# EAGLE board PCB-CCU-IRISCTRL (EAGLE 7.1.0)
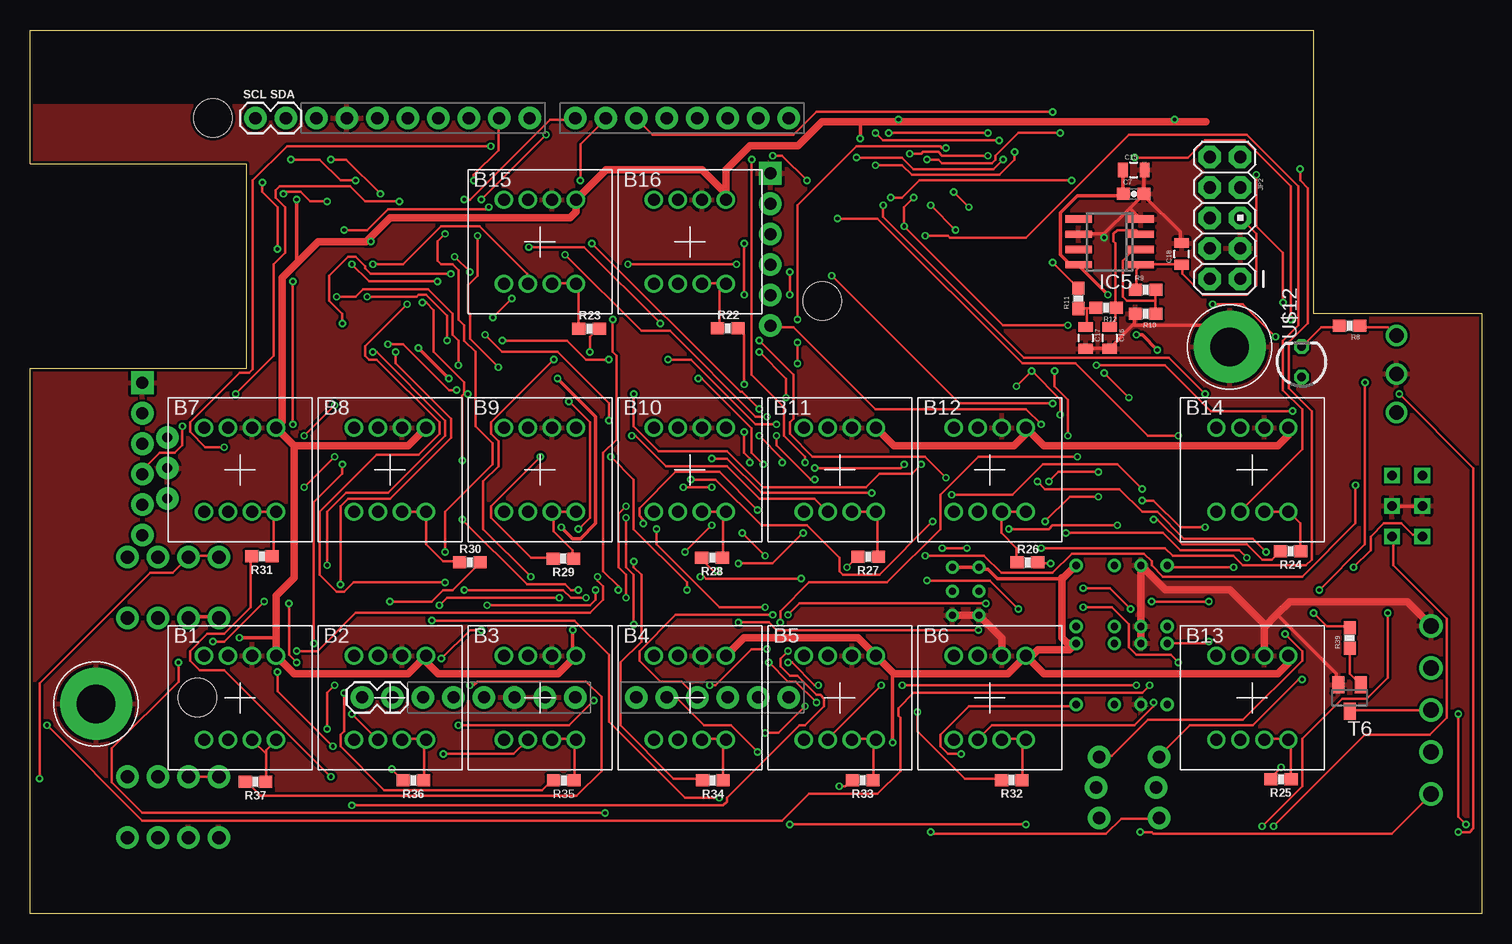
[diagram p5: board, top side]
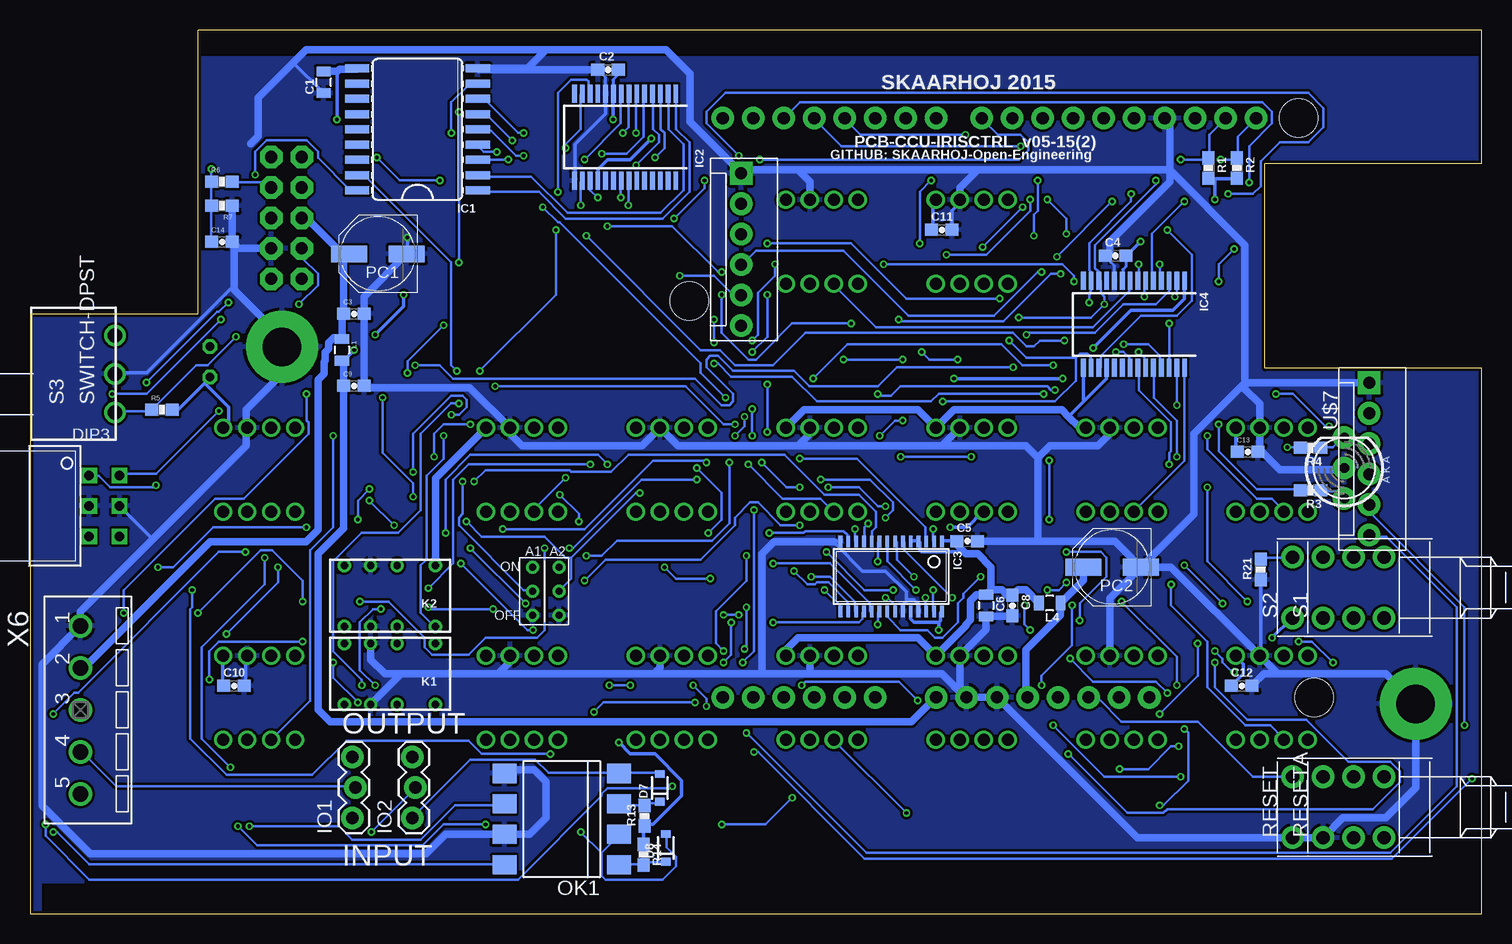
[diagram p6: board, bottom side, seen from below]

Size 121 x 73.66 mm. Coordinates in mm from the lower left corner, seen from the top.
Outline: 0,0 0,45.47 18.05,45.47 18.05,62.5 0,62.5 0,73.66 107,73.66 107,50 121,50 121,0 0,0
Copper layers (1*16): Top 0.035mm / dielectric 1.5mm / Bottom 0.035mm
Design rules "Fusion_eagle_rule_v1.1": minimum track width 6mil, minimum drill 12mil, track to track 6mil, track to pad 6mil, pad to pad 6mil, via to via 6mil, smd to smd 0mil, copper to edge 10mil, drill to drill 10mil, minimum pad ring 10mil, minimum via ring 6mil, stop-mask expansion 2mil, vias tented up to drill 100mil, thermal gap 10mil
Net classes: 0 default: width 0.203 mm, clearance 0.203 mm; 1 Power: width 0.305 mm, drill 0.305 mm, clearance 0.203 mm; 2 RELAY LINES: width 0.305 mm, drill 0.305 mm, clearance 0.203 mm; 3 INput lines: width 0.203 mm, clearance 0.203 mm
Holes 3.2 mm at 66.04,51.07 15.24,66.31 13.97,18.05
tRestrict: area 0,0 to 120,6.5; area 0,67.5 to 107,74
bRestrict: area 0,71.5 to 107,74; area 0,0 to 120,2.5

## Footprints (pad centres in the part's own frame; a part is rotated, then mirrored left to right if it is on the bottom)
NKK-NP01 = drill 1: 1 1,3.5; 2 -1,-3.5; L1 3,-3.5; L2 1,-3.5; L3 -1,3.5; L4 -3,3.5; LC1 3,3.5; LC2 -3,-3.5
0805 = smd 0.8 x 1.2: 1 -0.9,0; 2 0.9,0
0603-CAP = smd 1.1 x 1: 1 -0.85,0; 2 0.85,0
SOD-323 = smd 0.63 x 0.83: 1 -1.15,0; 2 1.15,0
P65SMT_UPRIGHT_TH = drill 0.8 square: P$1 -2.54,-1.27; P$2 0,-1.27; P$3 2.54,-1.27; P$4 2.54,1.27; P$5 0,1.27; P$6 -2.54,1.27
DUEMILANOVE_VIAS = drill 1.016 pad 1.88: 3.3V 50.8,13.97; 5V 50.8,16.51; A0 50.8,29.21; A1 50.8,31.75; A2 50.8,34.29; A3 50.8,36.83; A4 50.8,39.37; A5 50.8,41.91; AREF 2.54,2.54; D2 2.54,36.83; D3 2.54,34.29; D4 2.54,31.75; D5 2.54,29.21; D6 2.54,26.67; D7 2.54,24.13; D8 2.54,20.32; D9 2.54,17.78; D10 2.54,15.24; D11 2.54,12.7; D12 2.54,10.16; D13 2.54,7.62; GND@0 50.8,19.05; GND@1 50.8,21.59; GND@2 2.54,5.08; RES 50.8,11.43; RX 2.54,41.91; TX 2.54,39.37; VIN 50.8,24.13
SO18W = smd 0.66 x 2.032: 1 -5.08,-5.029; 2 -3.81,-5.029; 3 -2.54,-5.029; 4 -1.27,-5.029; 5 0,-5.029; 6 1.27,-5.029; 7 2.54,-5.029; 8 3.81,-5.029; 9 5.08,-5.029; 10 5.08,5.029; 11 3.81,5.029; 12 2.54,5.029; 13 1.27,5.029; 14 0,5.029; 15 -1.27,5.029; 16 -2.54,5.029; 17 -3.81,5.029; 18 -5.08,5.029
SSOP28 = smd 0.4 x 1.5: 1 -4.225,-3.625; 2 -3.575,-3.625; 3 -2.925,-3.625; 4 -2.275,-3.625; 5 -1.625,-3.625; 6 -0.975,-3.625; 7 -0.325,-3.625; 8 0.325,-3.625; 9 0.975,-3.625; 10 1.625,-3.625; 11 2.275,-3.625; 12 2.925,-3.625; 13 3.575,-3.625; 14 4.225,-3.625; 15 4.225,3.625; 16 3.575,3.625; 17 2.925,3.625; 18 2.275,3.625; 19 1.625,3.625; 20 0.975,3.625; 21 0.325,3.625; 22 -0.325,3.625; 23 -0.975,3.625; 24 -1.625,3.625; 25 -2.275,3.625; 26 -2.925,3.625; 27 -3.575,3.625; 28 -4.225,3.625
TSSOP28 = smd 0.305 x 0.991: 1 -4.225,-2.918; 2 -3.575,-2.918; 3 -2.925,-2.918; 4 -2.275,-2.918; 5 -1.625,-2.918; 6 -0.975,-2.918; 7 -0.325,-2.918; 8 0.325,-2.918; 9 0.975,-2.918; 10 1.625,-2.918; 11 2.275,-2.918; 12 2.925,-2.918; 13 3.575,-2.918; 14 4.225,-2.918; 15 4.225,2.918; 16 3.575,2.918; 17 2.925,2.918; 18 2.275,2.918; 19 1.625,2.918; 20 0.975,2.918; 21 0.325,2.918; 22 -0.325,2.918; 23 -0.975,2.918; 24 -1.625,2.918; 25 -2.275,2.918; 26 -2.925,2.918; 27 -3.575,2.918; 28 -4.225,2.918
SO08 = smd 0.6 x 2.2: 1 -1.905,-2.6; 2 -0.635,-2.6; 3 0.635,-2.6; 4 1.905,-2.6; 5 1.905,2.6; 6 0.635,2.6; 7 -0.635,2.6; 8 -1.905,2.6
1X03_LOCK = drill 1.016 pad 1.88: 1 0,0.127; 2 2.54,-0.127; 3 5.08,0.127
1X02 = drill 1.016 pad 1.88: 1 0,0; 2 2.54,0
AVR_ICSP = drill 1.016 pad 1.88 octagon: 1 -1.27,5.08; 2 1.27,5.08; 3 -1.27,2.54; 4 1.27,2.54; 5 -1.27,0; 6 1.27,0; 7 -1.27,-2.54; 8 1.27,-2.54; 9 -1.27,-5.08; 10 1.27,-5.08
MOLEX-1X6 = drill 1.016 pad 1.88 square: 1 0,0 | drill 1.016 pad 1.88: 2 2.54,0; 3 5.08,0; 4 7.62,0; 5 10.16,0; 6 12.7,0
DS2Y = drill 0.6: 1 1.2,0.46; 16 1.2,5.54; O1 4.4,0.46; O2 4.4,5.54; P1 6.6,0.46; P2 6.6,5.54; S1 8.8,0.46; S2 8.8,5.54
DIL8-SMD = smd 1.6 x 2: 1 -3.81,-4.77; 2 -1.27,-4.77; 3 1.27,-4.77; 4 3.81,-4.77; 5 3.81,4.77; 6 1.27,4.77; 7 -1.27,4.77; 8 -3.81,4.77
PANASONIC_D = smd 3 x 1.4: + 2.4,0; - -2.4,0
0603-RES = smd 1.1 x 1: 1 -0.85,0; 2 0.85,0
PUSHBUTTON = drill 1.1 pad 1.88: 1 2.54,2.54; 2 2.54,-2.54; 3 -2.54,2.54; 4 -2.54,-2.54
TECONNECTIVITY-DPST = drill 1.2: P$1 3,3.2; P$2 3,0; P$3 3,-3.2
SOT23 = smd 1 x 1.4: 1 -0.95,-1.1; 2 0.95,-1.1; 3 0,1.1
3.2MMPAD6MM = drill 3.2 pad 6: P$1 0,0
LED5MM-BICOLOR = drill 0.813 pad 1.88: A2 2.54,0; A3 -2.54,0; K1 0,0
LED3MM = drill 0.7 pad 1.2 octagon: A -1.27,0; K 1.27,0
2BITADDR = drill 0.6: A1 0,0; A2 2.2,0; H2 0,2; H3 2.2,2; L2 0,-2; L3 2.2,-2
MSTBV5-3.5 = drill 1.3: 1 -7,0; 2 -3.5,0; 3 0,0; 4 3.5,0; 5 7,0

## Placement (x,y rotation side)
B1  NKK-NP01-SINGLECOLOR  [NKK-NP01]  17.5,18 0 top
B2  NKK-NP01-SINGLECOLOR  [NKK-NP01]  30,18 0 top
B3  NKK-NP01-SINGLECOLOR  [NKK-NP01]  42.5,18 0 top
B4  NKK-NP01-SINGLECOLOR  [NKK-NP01]  55,18 0 top
B5  NKK-NP01-SINGLECOLOR  [NKK-NP01]  67.5,18 0 top
B6  NKK-NP01-SINGLECOLOR  [NKK-NP01]  80,18 0 top
B7  NKK-NP01-SINGLECOLOR  [NKK-NP01]  17.5,37 0 top
B8  NKK-NP01-SINGLECOLOR  [NKK-NP01]  30,37 0 top
B9  NKK-NP01-SINGLECOLOR  [NKK-NP01]  42.5,37 0 top
B10  NKK-NP01-SINGLECOLOR  [NKK-NP01]  55,37 0 top
B11  NKK-NP01-SINGLECOLOR  [NKK-NP01]  67.5,37 0 top
B12  NKK-NP01-SINGLECOLOR  [NKK-NP01]  80,37 0 top
B13  NKK-NP01-SINGLECOLOR  [NKK-NP01]  101.88,18 0 top
B14  NKK-NP01-SINGLECOLOR  [NKK-NP01]  101.88,37 0 top
B15  NKK-NP01-SINGLECOLOR  [NKK-NP01]  42.5,56 0 top
B16  NKK-NP01-SINGLECOLOR  [NKK-NP01]  55,56 0 top
C1  100nF  [0805]  96.52,69.31 90 bottom
C2  100nF  [0603-CAP]  72.81,70.35 0 bottom
C3  100nF  [0603-CAP]  94,50 0 bottom
C4  100nF  [0603-CAP]  30.51,54.86 0 bottom
C5  100nF  [0603-CAP]  42.87,31.07 0 bottom
C6  22uF  [0805]  41.3,25.7 270 bottom
C7  100nF  [0603-CAP]  92,60 0 top
C8  100nF  [0603-CAP]  39.1,25.7 270 bottom
C9  100nF  [0603-CAP]  94,44 0 bottom
C10  100nF  [0603-CAP]  104,19 0 bottom
C11  100nF  [0603-CAP]  45,57 0 bottom
C12  100nF  [0603-CAP]  20,19 0 bottom
C13  100nF  [0603-CAP]  19.5,38.5 0 bottom
C14  100nF  [0603-CAP]  105,56 0 bottom
C15  10uF/25V  [0805]  92,62 0 top
C16  1uF  [0805]  90,48 270 top
C17  1uF  [0805]  88,48 270 top
C18  10uF  [0805]  96,55 90 top
D7  1N4148  [SOD-323]  68.5,10.5 90 bottom
D8  1N4148  [SOD-323]  68,5.5 90 bottom
DIP3  BINARY_DIPUPRIGHT  [P65SMT_UPRIGHT_TH]  114.8,34 270 bottom
GND  ARDUINO_SHIELDNO_SILK  [DUEMILANOVE_VIAS]  21.34,68.85 270 top
IC1  ULN2803A  [SO18W]  88.7,65.38 90 bottom
IC2  MCP23017SS  [SSOP28]  71.39,64.73 180 bottom
IC3  PCA9685  [TSSOP28]  49.21,28.12 180 bottom
IC4  MCP23017SS  [SSOP28]  28.97,49.12 180 bottom
IC5  LM358D  [SO08]  90,56 90 top
IO1  [1X03_LOCK]  94,8 90 bottom
IO2  [1X03_LOCK]  89,8 90 bottom
JP1  [1X02]  27.69,18.05 0 top
JP2  M05X2PTH  [AVR_ICSP]  99.62,58 180 top
JP3  [MOLEX-1X6]  61.72,61.72 270 bottom
JP4  [1X02]  21.34,66.31 180 top
JP5  [MOLEX-1X6]  9.36,44.26 270 bottom
K1  RELAY5VIM03  [DS2Y]  86,23 180 bottom
K2  RELAY5VIM03  [DS2Y]  86,29.5 180 bottom
L1  ILHB0805ER121V  [0805]  95,47 270 bottom
L4  ILHB0805ER121V  [0805]  36,25.9 180 bottom
OK1  LTV826S  [DIL8-SMD]  76.67,7.9 90 bottom
PC1  47u  [PANASONIC_D]  92,55 180 bottom
PC2  47u  [PANASONIC_D]  30.8,28.9 180 bottom
R1  1K5  [0603-RES]  22.77,62.15 270 bottom
R2  1K5  [0603-RES]  20.4,62.15 270 bottom
R3  270  [0603-RES]  14.24,35.29 180 bottom
R4  270  [0603-RES]  14.24,38.83 180 bottom
R5  10K  [0603-RES]  110,42 0 bottom
R6  15K  [0603-RES]  105,61 0 bottom
R7  10K  [0603-RES]  105,59 180 bottom
R8  330R  [0603-RES]  110,49 180 top
R9  12K5  [0603-RES]  93,52 0 top
R10  22K  [0603-RES]  93,50 180 top
R11  22K  [0603-RES]  87.4,51.3 90 top
R12  10K  [0603-RES]  89.7,50.5 180 top
R13  330R  [0603-RES]  69.76,8.18 90 bottom
R14  330R  [0603-RES]  69.86,4.93 270 bottom
R21  10K  [0603-RES]  18.41,28.72 90 bottom
R22  100R  [0603-RES]  58.16,48.8 0 top
R23  100R  [0603-RES]  46.61,48.77 0 top
R24  100R  [0603-RES]  105.09,30.23 180 top
R25  100R  [0603-RES]  104.28,11.23 180 top
R26  100R  [0603-RES]  83.15,29.29 0 top
R27  100R  [0603-RES]  69.88,29.75 180 top
R28  100R  [0603-RES]  56.86,29.68 180 top
R29  100R  [0603-RES]  44.47,29.61 180 top
R30  100R  [0603-RES]  36.66,29.3 0 top
R31  100R  [0603-RES]  19.32,29.8 180 top
R32  100R  [0603-RES]  81.84,11.16 180 top
R33  100R  [0603-RES]  69.41,11.14 180 top
R34  100R  [0603-RES]  56.93,11.12 180 top
R35  100R  [0603-RES]  44.48,11.12 180 top
R36  100R  [0603-RES]  31.96,11.12 180 top
R37  100R  [0603-RES]  18.81,11 180 top
R39  10K  [0603-RES]  110,23 90 top
RESET  [PUSHBUTTON]  13.21,8.89 90 bottom
RESETA  [PUSHBUTTON]  10.67,8.89 90 bottom
S1  [PUSHBUTTON]  10.67,27.19 90 bottom
S2  [PUSHBUTTON]  13.21,27.19 90 bottom
S3  SWITCH-DPST  [TECONNECTIVITY-DPST]  116.9,45 0 bottom
T6  BC847  [SOT23]  110,18 180 top
U$4  GNDPAD6MM  [3.2MMPAD6MM]  100,47.25 0 top
U$7  LEDBICOLOR-AKA  [LED5MM-BICOLOR]  11.44,37.16 90 bottom
U$12  LED3MM  [LED3MM]  106,46 90 top
U$19  2BITADDR  [2BITADDR]  79.1,26.89 0 bottom
U$20  GNDPAD6MM  [3.2MMPAD6MM]  5.5,17.5 0 top
X6  MSTBV53.5MM  [MSTBV5-3.5]  116.8,17 270 bottom

## Tracks (layer width: path | path; a pad name or v marks a point on that pad's centre or on a via)
5V  (via drill 0.3)
  Top 0.305: S1.3 13.34,24.77 15.72,24.77 S2.3 | U$19.H3 76.99,28.89 79.06,28.89 U$19.H2 79.22,28.73 79.85,28.73 80.64,27.94 86,27.94 | 69.22,66 v69.22,64.61 | v71.91,14.29 71.91,19.84 72,20 | v22.23,59.53 22.23,54.61 22.42,54.42 | v45.24,23.65 45.24,21.59 B3.LC1 | v72.39,66.2 72.39,66 | v28.42,56.04 28.23,56.23 | v95.41,66.2 95.41,66 | 20.5,23.02 v17.46,23.02
  Top 0.61: B3.LC1 44,20 34,20 33,21 B2.LC1 31.5,20 22,20 B1.LC1 20.5,23.02 20.5,26.5 22,28 22,39 | 22,39 B7.LC1 21,41 21,53 22.42,54.42 24,56 28,56 28.23,56.23 30,58 45,58 45.5,58.5 B15.LC1 48,62 56,62 58,60 B16.LC1 58,62 60,64 64,64 66,66 69.22,66 72.39,66 95.41,66 98,66 | 22,39 31.5,39 B8.LC1 | B11.LC1 72,39 82,39 83,40 B12.LC1 84.5,39 104,39 104.88,39.88 B14.LC1 | B6.LC1 81.5,20 72,20 B5.LC1 69,23 59.5,23 B4.LC1 | B6.LC1 83.5,21.5 84,22 86.66,22 K1.1 86.46,22.54 86,23 86,27.94 86,28 86.16,28 K2.1 | B13.LC1 104.88,20.88 104,20 84.5,20 B6.LC1
  Bottom 0.254: C2.2 71.96,69.94 72.4,69.5 72.4,68.39 IC2.9 | C4.2 29.66,53.94 29.9,53.7 29.9,52.79 IC4.9
  Bottom 0.305: 106.44,44.21 106.05,44.61 U$12.A | 106.44,44.21 108.58,42.07 109.06,42.07 R5.2 | 45.24,24.29 45.09,24.45 45.09,25.08 IC3.28 | 45.24,24.29 47.31,24.29 47.62,24.61 47.62,25.08 IC3.24 | 22.23,61.28 22.7,61.28 R1.2 | 22.23,61.28 20.48,61.28 R2.2 | R14.1 69.85,5.87 69.85,7.3 R13.1 69.69,7.46 69.06,7.46 66.67,9.84 66.67,11.11 68.9,13.34 70.96,13.34 v71.91,14.29 | IC3.5 47.47,31.11 46.99,31.11 IC3.4 46.83,30.96 46.83,30.32 46.67,30.16 43.5,30.16 43.33,30.33 | IC3.1 44.93,31.11 44.29,31.11 44,31 | C12.1 20.8,19.05 19.84,20 19.84,20.8 20.48,21.43 B1.LC1 | C13.1 20.48,38.58 20.48,40.48 B7.LC1 | C11.1 45.72,57.15 45.72,59.21 45.56,59.37 B15.LC1 | C10.1 104.93,19.05 104.93,21.43 B13.LC1 | 34.44,41.44 33.1,42.78 | 33.1,42.78 31.27,44.61 31.27,45.4 IC4.18 | IC4.15 33.18,45.4 33.18,42.86 33.1,42.78 | v69.22,64.61 70.96,62.87 72.87,62.87 73.66,62.07 IC2.18 | v22.23,59.53 22.23,61.28 | v45.24,23.65 45.24,24.29 | v72.39,66.2 72.39,68.26 IC2.9 | v28.42,56.04 29.53,54.93 C4.2 | v95.41,66.2 95.41,70.01 95.39,70.21 | 106.44,44.21 104.46,42.23 104.46,40.96 104.78,40.64 B14.LC1 | v17.46,23.02 15.88,24.61 S2.3
  Bottom 0.61: L4.2 38,27 38.65,27 C8.1 39.55,26.55 40,27 40.9,27 | 40.9,27 C6.1 42.1,26.6 42.6,26.1 42.6,24.5 43,24.1 43,24 B3.LC1 47,23 57,23 58,22 B4.LC1 | C1.2 95.39,70.21 95.2,70.4 93.79,70.4 IC1.10 | 40.9,27 40.9,28.9 42,30 43,30 43.33,30.33 44,31 43.79,31 C5.1 | B8.LC1 33.5,40.5 34.44,41.44 35,42 44,42 B9.LC1 47,42 56.5,42 B10.LC1 | K2.1 87.2,36.3 B12.LC1
_IRIS_MANUAL  (via drill 0.3)
  Top 0.203: v98.58,50.8 101.12,50.8 v103.82,48.1
  Bottom 0.203: S3.P$3 113.82,41.91 110.97,41.91 R5.1 110.81,42.07 107.16,45.72 106.2,45.72 v103.82,48.1 | v98.58,50.8 97,52.39 97,53.34 98.27,54.61 98.27,55.4 JP2.4
A1  (via drill 0.3)
  Top 0.203: v45.72,32.07 46.67,33.02 46.67,40.96 v44.93,42.7 | v77.15,56.99 v75.09,59.05 | v85.88,41.59 85.88,42.86 v83.5,45.24 v82.23,43.97 | v89.06,36.83 85.72,36.83 v84.93,36.04 | v39.37,47.78 44.77,47.78 46.35,46.2 v48.26,46.2 | v53.18,46.2 55.09,46.2 60.48,40.8 v62.23,40.8
  Bottom 0.203: v45.72,32.07 45.72,31.11 IC3.2 | v44.93,42.7 35.56,42.7 33.81,44.45 33.81,46.35 | 33.81,46.35 33.5,46.67 32.86,46.67 32.54,46.35 32.54,45.56 IC4.16 | v75.09,59.05 75.09,60.96 IC2.16 | v77.15,56.99 77.15,51.59 v83.5,45.24 | v85.88,41.59 85.25,41.59 84.61,42.23 84.61,42.86 84.93,43.18 85.88,43.18 89.06,40.01 v89.06,36.83 | v84.93,36.04 84.93,33.34 85.25,33.02 85.25,32.38 79.85,26.99 79.22,26.99 U$19.A1 | 33.81,46.35 37.94,46.35 v39.37,47.78 | v53.18,46.2 v48.26,46.2 | v62.23,40.8 63.18,40.8 66.36,43.97 v82.23,43.97
A1CFG  (via drill 0.3)
  Top 0.203: S2.1 15.72,29.84 13.34,29.84 S1.1 13.18,29.69 11.91,28.42 10,28.42 0.79,19.21 v0.79,11.27 | v60.64,13.49 58.42,15.72 56.2,15.72 53.98,17.94 53.18,17.94 GND.A1
  Bottom 0.203: R21.2 18.41,29.69 15.88,29.69 S2.1 | v60.64,13.49 60.33,13.49 51.44,4.6 7.46,4.6 v0.79,11.27
A2  (via drill 0.3)
  Top 0.203: v56.83,37.94 58.1,37.94 60.96,35.08 v70.17,35.08 | v26.19,56.99 28.1,56.99 29.84,58.74 38.1,58.74 v38.26,58.9 | v41.59,55.56 46.2,55.56 v52.55,49.21 | v63.34,53.5 v63.34,51.59 | v73.66,59.69 72.87,58.9 v72.87,57.31 81.12,49.05 v86.52,49.05 | v84.61,32.7 86.68,34.77 v89.06,34.77 | v89.53,45.09 v91.6,43.02
  Bottom 0.203: v56.83,37.94 52.07,37.94 46.35,32.23 46.35,31.11 IC3.3 | v70.17,35.08 70.48,35.08 75.88,29.69 | 75.88,29.69 75.88,27.94 76.83,26.99 U$19.A2 | v26.19,56.99 24.13,54.93 24.13,51.12 25.4,49.85 28.42,49.85 31.75,46.51 31.75,45.56 IC4.17 | v41.59,55.56 v38.26,58.9 | v52.55,49.21 57.47,49.21 60.48,46.2 61.12,46.2 63.34,48.42 v63.34,51.59 | v63.34,53.5 63.66,53.5 67.47,57.31 v72.87,57.31 | v73.66,59.69 74.3,60.33 74.3,60.96 IC2.17 | 75.88,29.69 76.36,29.69 78.11,31.43 83.34,31.43 v84.61,32.7 | v89.06,34.77 89.06,35.88 91.6,38.42 v91.6,43.02 | v89.53,45.09 89.53,46.04 v86.52,49.05
ADDR1  (via drill 0.3)
  Top 0.203: v110.49,35.72 110.49,32.54 106.05,28.1 94.46,28.1 93.5,29.05 93.5,29.37 92.87,30 86.84,30 85.25,28.42 80.96,28.42 79.53,29.84 v74.61,29.84 | v62.71,37.62 62.71,37.94 v60.8,39.85 | v60.8,42.07 59.37,43.5 59.21,43.5 v46.83,55.88 | v45.88,61.12 45.88,64.14 47.94,66.2 GND.D6
  Bottom 0.203: v110.49,35.72 110.65,35.56 114.3,35.56 115.25,36.51 116.05,36.51 DIP3.P$1 | v74.61,29.84 73.34,29.84 72.07,31.11 64.14,31.11 62.71,32.54 v62.71,37.62 | v60.8,42.07 v60.8,39.85 | v46.83,55.88 46.83,60.17 v45.88,61.12
ADDR2  (via drill 0.3)
  Top 0.203: v103.66,7.3 111.28,14.92 116.68,14.92 118.11,16.35 118.11,24.61 113.67,29.05 113.67,31.43 DIP3.P$4 | v63.34,7.46 v83.03,7.46 | v57.47,9.68 54.61,9.68 48.26,16.03 48.26,21.59 45.4,24.45 v33.5,24.45 | v34.61,30.16 34.61,33.5 38.58,37.47 38.58,39.21 37.15,40.64 37.15,46.83 36.2,47.78 36.2,49.05 35.72,49.53 35.72,53.66 35.24,54.13 34.29,54.13 33.97,54.45 33.97,56.04 v34.61,56.67 | v36.2,59.53 36.67,59.53 43.34,66.2 45.4,66.2 GND.D7
  Bottom 0.203: v103.66,7.3 102.08,5.71 88.27,5.71 86.52,7.46 v83.03,7.46 | v63.34,7.46 59.69,7.46 v57.47,9.68 | v33.5,24.45 33.5,25.88 31.27,28.1 31.27,29.69 31.75,30.16 v34.61,30.16 | v34.61,56.67 34.61,57.94 v36.2,59.53
ADDR3  (via drill 0.3)
  Top 0.203: v110.33,28.89 111.76,30.32 111.76,31.43 112.87,32.54 114.3,32.54 115.25,31.59 116.05,31.59 DIP3.P$3 | v97.95,32.23 95.89,32.23 93.66,34.45 v92.71,34.45 | v90.65,32.38 85.25,32.38 84.93,32.07 v81.6,32.07 | v64.61,37.62 64.61,38.1 62.87,39.85 62.87,42.23 60.17,44.93 v60.17,62.87
  Bottom 0.203: v110.33,28.89 109.06,28.89 105.73,32.23 v97.95,32.23 | v90.65,32.38 v92.71,34.45 | v81.6,32.07 74.77,32.07 69.06,37.78 64.77,37.78 v64.61,37.62 | v60.17,62.87 38.58,62.87 37.78,63.66 37.78,64.29 38.42,64.93 40.32,64.93 41.59,66.2 GND.D8
ADDR4  (via drill 0.3)
  Top 0.203: v105.25,41.91 98.42,41.91 94.61,45.72 v88.9,45.72 | v39.05,45.56 36.67,47.94 36.67,50.01 36.51,50.16 36.51,52.39 37.31,53.18 v37.31,56.52 | v36.99,61.12 36.99,61.59 39.05,63.66 39.05,66.2 GND.D9
  Bottom 0.203: v105.25,41.91 110.49,36.67 113.51,36.67 DIP3.P$6 | v88.9,45.72 86.84,45.72 85.72,44.61 65.56,44.61 63.34,42.39 62.71,42.39 62.39,42.7 62.39,43.34 64.61,45.56 64.61,46.2 64.29,46.51 63.66,46.51 62.39,45.24 57.31,45.24 56.04,43.97 50.32,43.97 48.74,45.56 v39.05,45.56 | v37.31,56.52 37.31,58.26 36.99,58.58 v36.99,61.12
ARD_5V
  Bottom 0.61: PC2.+ 33.2,27.8 L4.1 35.1,24.9 38,22 38,18.2 GND.5V
D2  (via drill 0.3)
  Top 0.203: v21.91,52.7 v21.91,40.8 | v20.64,55.4 20.64,58.9 19.37,60.17 v19.37,60.96
  Bottom 0.203: v21.91,40.8 21.91,38.58 18.73,35.4 15.24,35.4 R3.2 | v21.91,52.7 21.91,54.13 v20.64,55.4 | v19.37,60.96 19.37,63.98 17.46,65.88 17.46,66.83 18.26,67.63 56.83,67.63 58.1,66.36 GND.D2
D3  (via drill 0.3)
  Top 0.203: v16.19,38.89 14.61,38.89 13.34,40.16 13.34,40.96 17.46,45.09 18.26,45.09 18.57,45.4 18.57,61.12 21.43,63.98 v38.42,63.98
  Bottom 0.203: v16.19,38.89 15.24,38.89 R4.2 | v38.42,63.98 53.34,63.98 55.56,66.2 GND.D3
FOLLOW_IRIS  (via drill 0.3)
  Top 0.203: v105.89,62.07 105.89,61.12 106.52,60.48 106.52,49.21 104.93,47.62 104.93,43.81 106.84,41.91 106.84,29.53 106.36,29.05 101.12,29.05 100.33,29.84 95.25,29.84 94.61,30.48 v84.3,30.48 | v79.69,25.88 64.14,25.88 v63.18,24.92 | v61.91,24.92 53.82,24.92 50.8,21.91 50.8,21.11 52.55,19.37 54.29,19.37 55.56,18.1 GND.A2
  Bottom 0.203: C14.1 105.89,56.04 105.89,58.9 R7.2 105.89,59.05 105.89,60.96 R6.1 105.89,61.12 v105.89,62.07 | v79.69,25.88 v84.3,30.48 | v61.91,24.92 v63.18,24.92
GND  (via drill 0.3)
  Top 0.305: C7.2 92.87,60.01 92.87,61.91 C15.2 | C18.2 95.89,56.04 95.89,56.83 92.87,59.85 C7.2 | 89.53,56.67 87.47,56.67 IC5.6 | 91.68,58.82 92.71,59.85 C7.2 | 91.68,58.82 89.53,56.67 | 91.68,58.82 92.55,57.94 IC5.4 | 92,49.13 90.01,47.15 C16.2 89.85,47.15 88.11,47.15 C17.2 | 92,49.13 92.08,49.21 92.08,49.85 R10.2 | DIP3.P$5 113.67,33.97 116.05,33.97 DIP3.P$2 | 103.95,24.95 108.9,20 108.9,19.21 T6.2 | 92,49.13 92.08,49.05 98.11,49.05 99.85,47.31 U$4.P$1 | v89.53,56.36 89.53,56.67
  Top 0.61: K1.P1 K2.P2 K2.P1 94.64,27 100,27 102.88,24.12 B13.1 102.88,23.88 103.95,24.95 105,26 114.8,26 X6.1 | B6.1 81,22.99 U$19.L2 U$19.L3
  Bottom 0.254: IC2.10 73.02,69.7 C2.1 | IC4.10 30.59,53.99 30.9,54.3 30.9,54.4 C4.1 | IC3.14 53.96,31.04 54,31
  Bottom 0.305: 47.86,26.11 48.26,25.72 48.26,25.24 IC3.23 | 47.86,26.11 47.78,26.19 47.31,26.19 46.99,25.88 46.99,25.24 IC3.25 | R21.1 18.41,21.75 B1.1 | C11.2 44.13,57.15 44.13,58.58 43.5,59.21 B15.1 | C10.2 103.03,19.05 103.03,21.43 B13.1 | C3.2 93.19,50.01 C3.2 | 99.05,70.95 96.52,68.42 C1.1 | IC2.15 75.56,61.12 75.56,64.14 73.03,66.67 73.03,68.26 IC2.10 | 47.86,26.11 47.94,26.19 47.94,26.83 49.69,28.57 51.59,28.57 53.82,30.8 54,31 | 110.77,31.23 113.51,33.97 DIP3.P$5 | S3.P$2 113.82,45.09 111.28,45.09 104.3,52.07 104,52 | v89.53,56.36 89.53,55.24 PC1.-
  Bottom 0.61: GND.GND@1 GND.GND@0 28.69,6.35 RESET.3 RESETA.3 11.56,8 8,8 5.5,10.5 U$20.P$1 8,20 17,20 | GND.GND@1 43.05,18.05 45,20 56,20 | 56,20 60,20 | 60,20 69,20 | 69,20 82,20 | PC1.- 93.15,51.45 C3.2 C9.2 93,43.85 84.35,43.85 B12.1 81,40 80,39 70,39 B11.1 67,39 57,39 | C14.2 104,55.85 104,52 100,48 U$4.P$1 100,45 103,42 103,40.62 B14.1 103,40.38 103,39 110.77,31.23 116.8,25.2 X6.1 120,20.8 120,9 116,5 88,5 86.37,6.63 OK1.7 79.37,6.63 78,8 78,11 79,12 81.15,12 OK1.5 | C14.2 R7.1 | JP2.3 103.61,55.46 C14.2 | B6.1 81,21 82,20 | B2.1 31,26.3 PC2.- | PC2.- 25.9,28.9 B1.1 17,20 | 17,20 18.15,20 C12.2 | JP5.1 19.74,44.26 | 19.74,44.26 24,40 24,33.3 PC2.- | 19.74,44.26 19.74,55.74 26,62 | 26,62 26,65.89 GND.GND@2 | 26,62 42,62 | 42,62 57,62 | 61.44,62 JP3.1 | C8.2 39.15,24.8 C6.2 41.3,23.7 B3.1 43.5,18.62 GND.GND@1 | 26,62 26,61 31,56 31,55.21 C4.1 | C2.1 83.56,70.35 IC1.9 79.54,70.46 78,72 | C5.2 37,31.07 | 37,31.07 30.57,31.07 PC2.- | B4.1 56,20 | 54,31 59,31 60,30 60,20 | 82,20 90.06,20 | 90.06,20 K1.P2 | 90.06,20 91.4,20 92.6,21.2 K1.P1 | B5.1 68.5,20.5 69,20 | B10.1 56,40 57,39 | 57,39 45,39 | 45,39 B9.1 | 45,39 38,39 37,38 | 37,38 37,31.07 | 19.74,44.26 19.74,43.74 18.5,42.5 B7.1 18.5,38.65 C13.2 18.3,38.5 16.8,37 11.6,37 U$7.K1 | B8.1 31,40 32,39 36,39 37,38 | 61.44,62 62,62 66,66 66,70 68,72 78,72 | 78,72 98,72 99.05,70.95 102,68 102,64.8 102.6,64.2 | 61.44,62 57,62 | 57,62 56,61 B16.1 | B15.1 43.5,60.5 42,62
  pour Top: 0,0 121,0 121,74 0,74
  pour Bottom: 0,0 121,0 121,74 0,74
GPA0  (via drill 0.3)
  Top 0.203: v30.48,46.83 30.48,45.88 35.08,41.27 35.08,39.69 30,34.61 26.51,34.61 25.88,33.97 v25.88,27.46
  Bottom 0.203: v30.48,46.83 29.84,46.83 29.37,46.35 29.37,45.56 IC4.21 | v25.88,27.46 25.88,25.72 22.86,22.7 22.86,18.89 19.68,15.72 17.62,15.72 16.51,14.61 B1.2
GPA1  (via drill 0.3)
  Top 0.203: v26.04,37.47 26.04,36.67 23.65,34.29 v23.65,22.54 | v26.83,16.67 28.89,14.61 B2.2
  Bottom 0.203: v26.04,37.47 26.04,38.42 25.88,38.58 25.88,40.96 28.57,43.66 28.57,45.4 IC4.22 | v23.65,22.54 23.65,19.84 v26.83,16.67
GPA2  (via drill 0.3)
  Top 0.203: v28.57,46.83 28.89,46.83 34.61,41.12 34.61,39.85 29.84,35.08 26.35,35.08 24.77,33.5 v24.77,29.05 | v21.59,25.88 21.59,21.59 v22.23,20.95 | v34.45,13.34 40.32,13.34 41.43,14.45 B3.2
  Bottom 0.203: v28.57,46.83 28.1,46.35 28.1,45.56 IC4.23 | v21.59,25.88 v24.77,29.05 | v22.23,20.95 22.23,18.89 19.53,16.19 14.61,16.19 11.11,12.7 7.62,12.7 6.83,11.91 6.83,10.95 9.05,8.73 26.19,8.73 26.51,8.41 29.53,8.41 v34.45,13.34
GPA3  (via drill 0.3)
  Top 0.203: v22.86,35.56 v25.4,38.1 | v19.53,26.04 16.19,22.7 v15.24,22.7 | v12.38,20.95 12.38,19.37 6.83,13.81 6.83,10.95 9.37,8.41 v47.94,8.41
  Bottom 0.203: v25.4,38.1 25.4,41.12 27.3,43.02 27.3,45.4 IC4.24 | v22.86,35.56 22.86,29.37 v19.53,26.04 | v15.24,22.7 14.13,22.7 v12.38,20.95 | v47.94,8.41 53.98,14.45 B4.2
GPA4  (via drill 0.3)
  Top 0.203: v29.84,47.47 31.11,47.47 34.92,43.66 v35.56,43.66 | v50.32,43.34 50.32,40.64 52.39,38.58 58.1,38.58 61.12,35.56 69.69,35.56 70.8,36.67 73.5,36.67 v74.3,37.47 | v87.79,27.15 90.01,27.15 v91.76,25.4 | v72.71,19.05 v92.23,19.05 | v70.96,19.05 66.52,14.61 B5.2
  Bottom 0.203: v29.84,47.47 27.78,47.47 26.83,46.51 26.83,45.56 IC4.25 | v35.56,43.66 35.88,43.66 36.2,43.97 48.42,43.97 49.21,43.18 50.16,43.18 v50.32,43.34 | v74.3,37.47 84.45,37.47 85.72,36.2 85.72,29.21 v87.79,27.15 | v91.76,25.4 92.39,25.4 93.5,24.29 93.5,20.32 v92.23,19.05 | v70.96,19.05 v72.71,19.05
GPA5  (via drill 0.3)
  Top 0.203: v26.04,49.21 26.04,50.01 24.92,51.12 24.92,53.18 26.51,54.77 27.15,54.77 27.94,53.98 27.94,53.82 28.42,53.34 v35.08,53.34 | v48.58,49.53 48.58,46.83 48.9,46.51 48.9,39.53 47.78,38.42 47.78,28.57 49.05,27.3 v49.05,26.99 | v56.83,32.38 v54.61,30.16 | v74.77,27.78 80.01,27.78 v82.39,25.4 | v87.79,25.56 90.17,25.56 91.6,24.13 91.6,22.23 92.23,21.59 95.09,21.59 v95.73,20.95 | v93.66,17.62 93.66,17.3 92.08,15.72 80.17,15.72 79.06,14.61 B6.2
  Bottom 0.203: v26.04,49.21 26.04,45.56 IC4.26 | v35.08,53.34 35.88,53.34 39.85,49.37 48.42,49.37 v48.58,49.53 | v49.05,26.99 51.44,26.99 v54.61,30.16 | v56.83,32.38 58.42,32.38 60.33,34.29 60.96,34.29 62.23,33.02 62.23,32.38 65.09,29.53 73.03,29.53 v74.77,27.78 | v82.39,25.4 87.63,25.4 v87.79,25.56 | v95.73,20.95 95.73,19.68 v93.66,17.62
GPA6  (via drill 0.3)
  Top 0.203: v22.86,39.85 v25.4,42.39
  Bottom 0.203: v25.4,42.39 25.4,45.4 IC4.27 | v22.86,39.85 22.86,38.73 18.73,34.61 17.46,34.61 16.51,33.66 B7.2
GPA7
  Bottom 0.203: IC4.28 24.77,45.4 24.77,37.78 28.89,33.66 B8.2
GPB0  (via drill 0.3)
  Top 0.305: v34.92,44.61 v32.38,47.15 | v43.97,44.61 47.15,41.43 47.15,32.54 45.88,31.27 45.24,31.27 v44.29,32.23
  Bottom 0.305: v32.38,47.15 29.21,50.32 25.72,50.32 24.77,51.28 24.77,52.7 IC4.1 | v43.97,44.61 v34.92,44.61 | v44.29,32.23 42.86,32.23 41.59,33.5 B9.2
GPB1  (via drill 0.3)
  Top 0.203: v25.56,51.44 27.15,51.44 27.78,52.07 33.18,52.07 35.24,50.01 35.24,48.26 35.72,47.78 v35.72,45.72 | v55.72,44.61 56.04,44.61 60.17,40.48 60.17,38.42 v61.12,37.47
  Bottom 0.203: v25.56,51.44 25.4,51.59 25.4,52.7 IC4.2 | v35.72,45.72 38.26,45.72 40.01,47.47 52.86,47.47 v55.72,44.61 | v61.12,37.47 58.26,34.61 55.09,34.61 54.13,33.66 B10.2
GPB2  (via drill 0.3)
  Top 0.203: v37.94,48.26 39.37,46.83 43.97,46.83 48.26,42.55 v48.26,41.12 | v50.16,39.85 50.48,39.85 53.02,37.31 58.1,37.31 60.8,34.61 65.41,34.61 66.36,33.66 B11.2
  Bottom 0.203: v37.94,48.26 37.78,48.42 32.23,48.42 29.84,50.8 27.15,50.8 26.04,51.91 26.04,52.7 IC4.3 | v48.26,41.12 48.9,41.12 v50.16,39.85
GPB3  (via drill 0.3)
  Top 0.203: v26.83,54.13 28.26,52.7 v33.97,52.7 | v58.9,54.13 v49.85,54.13 | v60.8,47.78 63.66,44.93 63.66,41.27 63.34,40.96 63.34,40.01 65.25,38.1 74.61,38.1 v76.36,36.35
  Bottom 0.203: v26.83,54.13 26.83,52.86 IC4.4 | v33.97,52.7 33.97,53.18 34.92,54.13 v49.85,54.13 | v58.9,54.13 58.9,53.18 60.33,51.75 60.33,48.26 v60.8,47.78 | v76.36,36.35 79.06,33.66 B12.2
GPB4  (via drill 0.3)
  Top 0.203: v24.77,59.37 23.34,59.37 22.54,60.17 21.27,60.17 v21.11,60.01 | v61.91,63.18 62.71,63.18 v64.77,61.12 | v67.31,57.94 70.64,57.94 82.71,45.88 87.15,45.88 93.19,39.85 v95.73,39.85
  Bottom 0.203: v24.77,59.37 27.46,56.67 27.46,52.86 IC4.5 | v21.11,60.01 19.05,60.01 18.41,60.64 18.41,62.71 16.83,64.29 14.45,64.29 13.18,65.56 13.18,67.15 14.45,68.42 63.02,68.42 64.61,66.83 64.61,65.88 v61.91,63.18 | v64.77,61.12 64.77,60.48 v67.31,57.94 | v95.73,39.85 95.73,32.23 97.63,30.32 97.63,17.78 100.81,14.61 B13.2
GPB5  (via drill 0.3)
  Top 0.203: v28.1,51.44 32.23,51.44 32.38,51.59 33.02,51.59 34.77,49.85 v34.77,47.78 | v74.61,56.52 76.52,56.52 76.68,56.36 83.03,56.36 91.6,64.93 101.44,64.93 105.73,60.64 105.73,49.05 104.46,47.78 104.46,43.66 106.05,42.07 106.05,38.73 100.97,33.66 B14.2
  Bottom 0.203: v28.1,51.44 28.1,52.7 IC4.6 | v34.77,47.78 36.83,47.78 37.31,47.31 37.94,47.31 39.05,48.42 56.36,48.42 59.05,45.72 62.23,45.72 63.5,46.99 65.09,46.99 v74.61,56.52
GPB6  (via drill 0.3)
  Top 0.203: v28.57,54.13 31.11,54.13 34.29,57.31 37.47,57.31 41.43,53.34 41.43,52.55 B15.2
  Bottom 0.203: v28.57,54.13 28.57,52.86 IC4.7
GPB7
  Bottom 0.203: IC4.8 29.37,52.7 29.37,51.91 32.38,48.9 50.48,48.9 53.98,52.39 B16.2
I2C_SCL  (via drill 0.3)
  Top 0.203: v46.35,26.35 45.09,26.35 44.45,26.99 v36.2,26.99 | v34.61,27.62 26.99,27.62 26.19,26.83 25.56,26.83 24.13,28.26 24.13,33.5 28.89,38.26 32.38,38.26 34.13,40.01 34.13,40.96 28.89,46.2 28.26,46.2 27.94,46.51 27.94,47.31 v31.43,50.8 | v78.26,58.9 v76.99,60.17 | v63.02,43.02 63.02,44.61 v60.8,46.83 | v59.53,55.88 v59.53,51.59 | v38.58,49.69 v40.16,51.28 | v21.75,62.87 24.13,62.87 25.88,61.12 v27.15,61.12
  Bottom 0.203: JP4.2 18.89,66.2 20.32,64.77 20.32,63.02 R2.1 20.48,62.87 v21.75,62.87 | v46.35,26.35 46.35,25.24 IC3.26 | v36.2,26.99 35.24,26.99 v34.61,27.62 | v76.99,60.17 76.99,68.42 75.88,69.53 74.61,69.53 74.45,69.37 74.45,68.42 IC2.12 | v78.26,58.9 76.99,57.63 76.83,57.63 65.09,45.88 65.09,45.09 v63.02,43.02 | v60.8,46.83 59.53,48.1 v59.53,51.59 | v59.53,55.88 52.55,55.88 47.94,51.28 v40.16,51.28 | v38.58,49.69 32.54,49.69 v31.43,50.8 31.43,51.44 31.75,51.75 31.75,52.7 IC4.12 31.91,52.86 31.91,53.5 32.23,53.82 32.23,55.72 27.15,60.8 v27.15,61.12
I2C_SDA  (via drill 0.3)
  Top 0.203: v45.72,26.99 45.09,26.99 44.61,27.46 41.43,27.46 v36.04,32.86 | v36.04,37.78 36.04,43.18 36.2,43.34 | 36.2,43.34 36.2,44.29 33.66,46.83 33.66,50.32 33.02,50.96 v32.7,50.96 | v76.36,63.82 76.04,63.82 75.88,63.98 68.9,63.98 63.98,59.05 v63.98,49.53 | v63.98,45.88 v63.98,47.62 | 36.2,43.34 v36.51,43.34 | v25.08,62.87 26.35,62.87 v29.21,60.01
  Bottom 0.203: JP4.1 21.43,66.2 22.7,64.93 22.7,63.02 R1.1 22.86,62.87 v25.08,62.87 | v45.72,26.99 45.72,25.24 IC3.27 | v36.04,37.78 v36.04,32.86 | v32.7,50.96 32.7,51.75 32.54,51.91 32.54,52.7 IC4.13 32.54,52.86 32.54,53.5 32.7,53.66 32.7,55.88 29.21,59.37 v29.21,60.01 | v76.36,63.82 76.36,64.14 75.09,65.41 75.09,68.26 IC2.13 | v63.98,47.62 v63.98,49.53 | v63.98,45.88 63.66,45.88 62.55,44.77 57.47,44.77 55.4,42.7 45.88,42.7 45.24,43.34 v36.51,43.34
IRIS_CONTROL
  Top 0.203: R9.1 92.23,52.07 92.23,53.66 92.55,53.98 IC5.1 92.71,54.13 95.89,54.13 C18.1 96.04,53.98 96.04,53.34 97.79,51.59 101.44,51.59 102.23,52.39 102.23,56.67 100.97,57.94 JP2.5
L0
  Top 0.203: 19.68,13.34 19.68,13.65 20.48,14.45 B1.L1 | 19.68,13.34 19.68,11.11 R37.1 | 19.68,13.34 18.57,14.45 B1.L2
L1
  Top 0.203: R36.1 32.86,11.27 32.86,14.45 B2.L1 32.86,14.61 31.11,14.61 B2.L2
L2
  Top 0.203: R35.1 45.4,11.27 45.4,14.45 B3.L1 45.4,14.61 43.66,14.61 B3.L2
L3
  Top 0.203: R34.1 57.78,11.27 57.78,14.29 57.94,14.45 B4.L1 57.94,14.61 56.04,14.61 B4.L2
L4
  Top 0.203: R33.1 70.33,11.27 70.33,14.29 70.48,14.45 B5.L1 70.48,14.61 68.58,14.61 B5.L2
L5
  Top 0.203: R32.1 82.71,11.27 82.71,14.29 82.87,14.45 B6.L1 82.87,14.61 81.12,14.61 B6.L2
L6
  Top 0.203: 20.48,33.5 20.32,33.34 20.32,29.84 R31.1 | 20.48,33.5 18.57,33.5 B7.L2 | 20.48,33.5 B7.L1
L7
  Top 0.203: R30.1 35.72,29.37 34.45,29.37 33.02,30.8 33.02,33.5 B8.L1 32.86,33.5 31.11,33.5 B8.L2
L8
  Top 0.203: 43.66,33.5 43.66,31.91 45.24,30.32 45.24,29.69 R29.1 | 43.66,33.5 45.4,33.5 B9.L1 | 43.66,33.5 B9.L2
L9
  Top 0.203: 57.94,33.5 57.78,33.34 57.78,29.69 R28.1 | 57.94,33.5 56.04,33.5 B10.L2 | 57.94,33.5 B10.L1
L10
  Top 0.203: R27.1 70.64,29.84 70.64,33.5 B11.L1 70.48,33.5 68.58,33.5 B11.L2
L11
  Top 0.203: R26.1 82.23,29.37 82.23,30.48 80.96,31.75 80.96,33.5 B12.L2 81.12,33.5 82.87,33.5 B12.L1
L12
  Top 0.203: R25.1 105.09,11.27 105.09,14.29 B13.L1 104.78,14.61 103.03,14.61 B13.L2
L13
  Top 0.203: R24.1 105.89,30.32 105.89,32.54 104.93,33.5 B14.L1 104.78,33.5 103.03,33.5 B14.L2
L14
  Top 0.203: R23.1 45.72,48.9 45.72,52.23 45.56,52.39 B15.L1 45.4,52.55 43.66,52.55 B15.L2
L15
  Top 0.203: R22.1 57.47,48.9 57.47,51.91 57.94,52.39 B16.L1 57.94,52.55 56.04,52.55 B16.L2
N$1  (via drill 0.3)
  Top 0.203: v100.33,28.89 94.93,28.89 K2.S1 | v104.62,23.34 106.05,21.91 106.05,21.11 101.12,16.19 93.19,16.19 90.17,13.18 89.22,13.18 IO2.3
  Bottom 0.203: v100.33,28.89 100.33,27.62 v104.62,23.34
N$2  (via drill 0.3)
  Top 0.203: v61.28,29.84 v59.37,31.75 | v63.18,21.91 62.55,21.27 62.55,20.64 63.34,19.84 63.98,19.84 65.56,18.26 65.88,18.26 66.2,17.94 66.2,17.3 64.61,15.72 64.14,15.72 58.1,9.68 58.1,9.37 57.78,9.05 v26.83,9.05 | v24.77,15.4 24.77,18.41 v25.4,19.05 | v30,26.04 33.5,26.04 34.45,26.99 35.24,26.99 37.47,29.21 R30.2
  Bottom 0.203: v59.37,31.75 56.52,31.75 56.36,31.91 53.18,31.91 52.86,31.59 52.86,31.11 IC3.13 | v61.28,29.84 61.28,27.78 63.82,25.24 63.82,22.54 v63.18,21.91 | v26.83,9.05 26.51,9.05 24.45,11.11 24.45,15.08 v24.77,15.4 | v25.4,19.05 25.4,21.43 v30,26.04
N$3  (via drill 0.3)
  Top 0.203: v12.7,40.64 12.7,39.05 12.06,38.42 10.79,38.42 9.37,36.99 9.37,36.67 JP5.4 | v17.14,43.34 20.32,46.51 20.32,54.13 21.27,55.09 21.27,58.9 20.48,59.69 20.48,60.33 20.8,60.64 26.67,60.64 27.94,59.37 v30.8,59.37 | v36.67,53.5 v35.4,54.77
  Bottom 0.203: v12.7,40.64 13.02,40.64 15.72,43.34 v17.14,43.34 | v35.4,54.77 v30.8,59.37 | v36.67,53.5 36.99,53.5 40.64,49.85 47.78,49.85 53.18,55.24 60.48,55.24 61.59,54.13 JP3.4
N$4  (via drill 0.3)
  Top 0.203: v102.23,61.59 102.23,57.31 104.46,55.09 v104.46,50.96 | v111.28,44.29 111.28,30.8 v107.47,26.99 | v77.63,13.34 76.52,13.34 75.88,13.97 75.88,14.92 78.26,17.3 87.15,17.3 K1.16
  Bottom 0.203: v102.23,61.59 102.23,63.5 101.28,64.45 97.95,64.45 97,63.5 97,63.02 94.3,60.33 93.82,60.33 IC1.18 | v104.46,50.96 105.25,50.16 105.41,50.16 v111.28,44.29 | v107.47,26.99 107.47,25.56 107.63,25.4 107.63,14.61 104.62,11.59 97.47,11.59 94.61,14.45 84.45,14.45 83.34,13.34 v77.63,13.34
N$5
  Bottom 0.203: IC2.1 67.15,68.26 67.15,65.41 66.04,64.29 66.04,60.17 68.26,57.94 76.36,57.94 78.58,60.17 83.66,60.17 IC1.1
N$6  (via drill 0.3)
  Top 0.203: v92.55,6.83 93.5,6.83 93.66,6.67 113.51,6.67 116.68,9.84 X6.5
  Bottom 0.203: v92.55,6.83 88.9,10.48 IO2.2
N$7
  Bottom 0.203: R4.1 13.34,38.89 12.38,38.89 11.59,39.69 U$7.A2
N$8  (via drill 0.3)
  Top 0.203: v1.43,15.72 9.37,7.78 62.71,7.78 64.93,10 70.64,10 72.55,11.91 72.55,16.35 72.39,16.51 72.39,17.14 73.66,18.41 92.71,18.41 v93.34,19.05 | v85.25,42.55 77.47,42.55 v66.83,53.18
  Bottom 0.203: v1.43,15.72 1.43,25.56 9.21,33.34 9.21,33.97 JP5.5 | v93.34,19.05 93.34,19.53 95.73,21.91 95.73,29.37 93.34,31.75 90.33,31.75 88.42,33.66 88.42,40.01 85.88,42.55 v85.25,42.55 | v66.83,53.18 63.98,53.18 62.39,51.59 61.75,51.59 JP3.5
N$9  (via drill 0.3)
  Top 0.203: v85.41,45.24 85.41,43.97 86.52,42.86 v86.52,39.85
  Bottom 0.203: v85.41,45.24 85.88,45.72 85.88,54.29 93.03,61.44 93.66,61.44 IC1.17 | v86.52,39.85 86.52,37.94 87.95,36.51 87.95,29.53 88.42,29.05 88.42,25.08 87.31,23.97 K2.16
N$10  (via drill 0.3)
  Top 0.203: v98.27,22.7 98.11,22.54 94.93,22.54 K1.S1 | v106.05,19.53 105.73,19.53 101.92,15.72 96.68,15.72 94.14,13.18 IO1.3
  Bottom 0.203: v98.27,22.7 105.25,22.7 106.05,21.91 v106.05,19.53
N$11
  Bottom 0.203: R3.1 13.34,35.24 12.06,35.24 11.59,34.77 U$7.A3
N$12
  Bottom 0.203: IO1.2 93.98,10.64 113.82,10.64 116.68,13.49 X6.4
N$13
  Top 0.203: R39.1 110.01,22.07 110.01,20 110.81,19.21 T6.1
N$14
  Bottom 0.203: R6.2 104.14,60.96 101.28,60.96 100.97,60.64 JP2.7
N$15
  Top 0.203: R8.1 110.97,48.9 113.19,48.9 113.82,48.26 S3.P$1
N$16
  Bottom 0.61: JP2.6 98,58 95,55 PC1.+ 94.85,54.55 C3.1 95,49.85 L1.1 95.1,48 95.7,48 96.1,47.6 96.1,47.1 96.4,46.8 96.4,46.1 96.5,46 96.5,45 97,44.5 97,32 98,31 106,31 116.5,20.5 X6.2
N$17
  Top 0.203: R8.2 109.06,48.9 107.63,48.9 106.05,47.31 U$12.K
N$18
  Top 0.203: 88.11,50.48 88.74,50.48 R12.2 | 88.11,50.48 87.47,50.48 R11.1 | 88.11,50.48 88.11,49.05 C17.1
N$19  (via drill 0.3)
  Top 0.203: v52.23,32.07 52.23,30.8 57.47,25.56 v61.28,25.56 | v61.44,22.07 60.17,22.07 57.15,19.05 v56.67,19.05 | v46.99,17.78 44.93,15.72 v35.72,15.72 | v25.08,11.43 16.19,20.32 14.13,20.32 13.34,21.11 13.34,21.91 14.76,23.34 16.19,23.34 18.41,25.56 18.41,29.69 R31.2
  Bottom 0.203: v52.23,32.07 52.23,31.11 IC3.12 | v61.28,25.56 61.28,22.23 v61.44,22.07 | v56.67,19.05 56.36,19.37 48.58,19.37 v46.99,17.78 | v35.72,15.72 31.43,11.43 v25.08,11.43
N$20
  Top 0.203: C16.1 90.01,49.05 90.49,49.53 90.49,50.48 R12.1 90.49,50.64 90.49,55.88 90.33,56.04 90.33,56.67 90.65,56.99 92.23,56.99 92.55,56.67 IC5.3
N$22
  Top 0.203: 93.82,51.12 93.82,51.91 R9.2 | 93.82,51.12 93.82,50.01 R10.1 | 93.82,51.12 91.44,51.12 91.12,51.44 91.12,54.45 91.92,55.24 92.55,55.24 IC5.2
N$23  (via drill 0.3)
  Top 0.203: v51.12,32.54 51.12,32.86 50.8,33.18 50.8,33.81 53.82,36.83 57.47,36.83 v60.64,33.66 | v61.59,20.95 63.18,19.37 63.82,19.37 v65.56,17.62 | v73.98,16.83 73.98,15.24 77.95,11.27 80.96,11.27 R32.2
  Bottom 0.203: v51.12,32.54 51.44,32.23 51.44,31.11 IC3.11 | v60.64,33.66 60.64,21.91 v61.59,20.95 | v65.56,17.62 73.18,17.62 v73.98,16.83
N$31  (via drill 0.3)
  Top 0.203: v83.98,36.04 84.61,35.4 90.81,35.4 92.71,33.5 93.98,33.5 96.2,31.27 101.92,31.27 v103.03,30.16 | v119.06,16.67 119.06,8.1 v119.7,7.46 | v67.47,10.64 67.94,10.64 68.42,11.11 R33.2
  Bottom 0.203: v83.98,36.04 83.03,36.99 76.04,36.99 75.88,36.83 72.55,36.83 71.12,38.26 58.1,38.26 54.77,34.92 51.91,34.92 50.48,33.5 50.48,32.23 50.8,31.91 50.8,31.11 IC3.10 | v103.03,30.16 105.25,30.16 117,18.41 117.32,18.41 v119.06,16.67 | v119.7,7.46 119.7,6.51 116.05,2.86 80.33,2.86 73.34,9.84 73.34,10 72.87,10.48 67.63,10.48 v67.47,10.64
N$34
  Bottom 0.203: IC2.2 67.79,68.26 67.79,65.41 66.52,64.14 66.52,60.33 68.42,58.42 76.2,58.42 79.22,61.44 83.66,61.44 IC1.2
N$35  (via drill 0.3)
  Top 0.203: v68.9,63.02 72.71,63.02 73.66,62.07 80.33,62.07 v81.12,62.87
  Bottom 0.203: v68.9,63.02 68.1,63.82 68.1,65.09 68.42,65.41 68.42,68.26 IC2.3 | v81.12,62.87 83.66,62.87 IC1.3
N$36  (via drill 0.3)
  Top 0.203: v70.48,62.39 72.71,62.39 73.5,61.59 80.8,61.59 82.07,62.87 v82.07,63.5
  Bottom 0.203: v70.48,62.39 68.58,64.29 68.58,64.93 69.06,65.41 69.06,68.26 IC2.4 | v82.07,63.5 83.19,63.5 83.66,63.98 IC1.4
N$37  (via drill 0.3)
  Top 0.203: v73.34,63.34 74.3,63.34 74.45,63.5 75.72,63.5 76.04,63.18 v79.85,63.18
  Bottom 0.203: v73.34,63.34 71.28,63.34 69.85,64.77 69.85,68.26 IC2.5 | v79.85,63.18 80.49,63.18 82.55,65.25 83.66,65.25 IC1.5
N$38  (via drill 0.3)
  Top 0.203: v70.48,65.09 71.12,64.45 v80.8,64.45
  Bottom 0.203: v70.48,65.09 70.48,68.26 IC2.6 | v80.8,64.45 82.87,66.52 83.66,66.52 IC1.6
N$39  (via drill 0.3)
  Top 0.203: v79.85,65.09 v71.6,65.09
  Bottom 0.203: v71.6,65.09 71.12,65.56 71.12,68.26 IC2.7 | v79.85,65.09 80.33,65.09 83.03,67.79 83.66,67.79 IC1.7
N$40  (via drill 0.3)
  Top 0.203: v74.77,62.87 75.72,62.87 76.04,62.55 80.17,62.55 80.49,62.87 80.49,63.18 82.39,65.09 v85.88,65.09
  Bottom 0.203: v74.77,62.87 71.75,65.88 71.75,68.26 IC2.8 | v85.88,65.09 85.88,67.63 84.45,69.06 83.82,69.06 IC1.8
N$45  (via drill 0.3)
  Top 0.203: v61.28,15.08 62.39,15.08 v64.61,17.3 | v65.72,19.05 65.41,19.05 63.5,20.95 v63.18,20.95 | v62.55,24.29 62.55,25.24 64.93,27.62 71.44,27.62 75.88,32.07 75.88,34.92 79.06,38.1 v87.31,38.1 | v84.3,40.8 83.03,42.07 70.48,42.07 63.66,48.9 61.75,48.9 JP3.6
  Bottom 0.203: v61.28,15.08 51.28,5.08 7.62,5.08 2.06,10.64 2.06,25.56 7.94,31.43 9.21,31.43 JP5.6 | v64.61,17.3 64.61,17.94 v65.72,19.05 | v63.18,20.95 62.55,21.59 v62.55,24.29 | v87.31,38.1 87.31,40.01 86.52,40.8 v84.3,40.8
N$47
  Bottom 0.203: D7.1 68.58,9.21 69.53,9.21 69.69,9.05 R13.2 69.85,9.05 71.75,9.05 OK1.3
N$48
  Bottom 0.203: D8.1 68.1,4.29 69.69,4.29 69.85,4.13 R14.2 70.01,4.13 71.75,4.13 OK1.1
N$49  (via drill 0.3)
  Top 0.203: v75.09,6.83 75.25,6.67 89.69,6.67 90.96,7.94 93.98,7.94 IO1.1
  Bottom 0.203: 73.34,5.08 73.34,3.17 73.03,2.86 68.26,2.86 67.15,3.97 67.15,4.76 67.94,5.56 67.94,6.51 D8.2 | 73.34,5.08 71.91,6.51 OK1.2 | 73.34,5.08 v75.09,6.83
N$51  (via drill 0.3)
  Top 0.203: v71.75,59.69 72.71,59.69 74.14,61.12 v86.84,61.12 | v92.08,63.02 96.52,63.02 97.95,64.45 101.28,64.45 105.09,60.64 v105.09,49.53 | v114.14,43.34 120.33,37.15 120.33,7.14 120.02,6.83 v119.06,6.83
  Bottom 0.203: v71.75,59.69 71.75,60.96 IC2.21 | v86.84,61.12 90.17,61.12 v92.08,63.02 | v105.09,49.53 111.28,43.34 v114.14,43.34 | v119.06,6.83 118.75,6.83 116.05,4.13 81.6,4.13 OK1.8
N$58  (via drill 0.3)
  Top 0.203: v50.32,29.37 50.32,28.89 50.96,28.26 50.96,22.7 49.21,20.95 49.21,15.72 53.66,11.27 56.04,11.27 R34.2
  Bottom 0.203: v50.32,29.37 50.32,30.96 IC3.9
N$59  (via drill 0.3)
  Top 0.203: v47.15,26.99 47.15,26.19 46.67,25.72 v38.1,25.72 | v37.62,23.65 36.67,23.65 v34.29,21.27 | v26.19,18.41 26.19,15.24 25.88,14.92 25.88,13.97 29.53,10.32 42.7,10.32 43.5,11.11 R35.2
  Bottom 0.203: v47.15,26.99 49.53,29.37 49.53,30.96 IC3.8 | v38.1,25.72 38.1,24.13 v37.62,23.65 | v34.29,21.27 32.38,19.37 27.15,19.37 v26.19,18.41
N$60
  Bottom 0.203: D7.2 68.58,11.75 71.75,11.75 OK1.4 71.91,11.75 77.79,11.75 78.9,12.86 84.3,12.86 89.06,8.1 IO2.1
N$67  (via drill 0.3)
  Top 0.203: v47.31,28.1 47.31,27.78 47.78,27.3 47.78,26.19 46.67,25.08 27.15,25.08 23.97,21.91 v22.23,21.91 | v20.64,20.16 20.64,18.57 v25.24,13.97 | v30.16,12.06 30.96,11.27 R36.2
  Bottom 0.203: v47.31,28.1 48.74,29.53 48.74,30.96 IC3.7 | v22.23,21.91 21.59,21.27 21.59,20.95 20.8,20.16 v20.64,20.16 | v25.24,13.97 25.88,13.97 27.78,12.06 v30.16,12.06
N$68  (via drill 0.3)
  Top 0.203: v71.12,59.05 71.12,58.1 82.87,46.35 94.93,46.35 v97.95,43.34 | v113.19,25.08 113.19,19.68 111.44,17.94 109.38,17.94 106.05,14.61 106.05,10.64 v102.71,7.3
  Bottom 0.203: v71.12,59.05 71.12,60.96 IC2.22 | v97.95,43.34 97.95,41.12 97.79,40.96 97.79,40.01 103.19,34.61 105.57,34.61 113.19,26.99 v113.19,25.08 | v102.71,7.3 95.25,7.3 94.14,6.19 88.42,6.19 85.57,9.05 81.6,9.05 OK1.6
N$74  (via drill 0.3)
  Top 0.203: v44.13,26.35 34.77,26.35 v34.13,25.72 | v36.67,19.05 36.99,19.05 37.31,19.37 46.35,19.37 47.62,18.1 47.62,11.91 45.56,9.84 19.21,9.84 18.1,10.95 R37.2
  Bottom 0.203: v44.13,26.35 48.1,30.32 48.1,30.96 IC3.6 | v34.13,25.72 34.13,22.38 36.67,19.84 v36.67,19.05
N$75  (via drill 0.3)
  Top 0.203: v54.77,26.99 54.77,27.62 50.32,32.07 50.32,36.2 v48.42,38.1 | v42.55,38.1 38.42,33.97 38.42,33.02 41.75,29.69 43.5,29.69 R29.2
  Bottom 0.203: v54.77,26.99 53.5,25.72 53.5,25.24 IC3.15 | v42.55,38.1 v48.42,38.1
N$76  (via drill 0.3)
  Top 0.203: v57.31,28.57 56.99,28.57 56.04,29.53 R28.2
  Bottom 0.203: v57.31,28.57 56.2,27.46 55.56,27.46 55.4,27.62 54.45,27.62 52.86,26.04 52.86,25.24 IC3.16
N$77  (via drill 0.3)
  Top 0.203: v55.88,28.1 56.2,28.1 56.36,27.94 v64.29,27.94 | v68.1,28.89 68.9,29.69 R27.2
  Bottom 0.203: v55.88,28.1 54.29,28.1 52.23,26.04 52.23,25.24 IC3.17 | v64.29,27.94 67.15,27.94 v68.1,28.89
N$78  (via drill 0.3)
  Top 0.203: v59.05,24.29 61.59,24.29 62.23,23.65 v79.06,23.65 | v85.09,29.21 84.14,29.21 R26.2
  Bottom 0.203: v59.05,24.29 51.91,24.29 51.59,24.61 51.59,25.08 IC3.18 | v79.06,23.65 79.53,23.65 v85.09,29.21
N$79  (via drill 0.3)
  Top 0.203: v59.05,29.21 61.91,29.21 v64.45,31.75 | v65.41,37.15 72.55,37.15 v72.87,37.47 | v86.36,31.75 94.46,31.75 95.89,30.32 100.81,30.32 v101.44,29.69 | v104.3,12.22 103.35,11.27 R25.2
  Bottom 0.203: v59.05,29.21 54.29,29.21 50.96,25.88 50.96,25.24 IC3.19 | v64.45,31.75 63.34,32.86 63.34,35.08 v65.41,37.15 | v72.87,37.47 73.66,38.26 84.3,38.26 86.36,36.2 v86.36,31.75 | v101.44,29.69 101.44,27.46 106.68,22.23 106.68,14.61 v104.3,12.22
N$80  (via drill 0.3)
  Top 0.203: v50.32,24.13 50.32,28.26 49.69,28.89 v49.69,33.02 | v55.09,36.2 57.15,36.2 60.96,32.38 64.77,32.38 67.47,29.69 67.47,28.57 67.79,28.26 70.8,28.26 v75.25,32.7 | v76.83,34.92 81.92,34.92 84.45,37.47 90.65,37.47 v92.71,35.4 | v93.66,32.86 93.98,32.86 96.04,30.8 101.44,30.8 102.71,29.53 103.5,29.53 104.14,30.16 R24.2
  Bottom 0.203: v50.32,24.13 50.32,25.08 IC3.20 | v49.69,33.02 49.05,33.66 49.05,34.29 50.96,36.2 v55.09,36.2 | v75.25,32.7 75.25,33.34 v76.83,34.92 | v92.71,35.4 93.66,34.45 v93.66,32.86
N$81  (via drill 0.3)
  Top 0.203: v41.75,28.1 37.78,32.07 37.78,36.04 39.05,37.31 39.05,39.37 38.42,40.01 38.42,40.96 v43.66,46.2 | v46.67,46.83 46.67,48.1 47.31,48.74 R23.2
  Bottom 0.203: v41.75,28.1 43.18,26.67 43.18,26.35 43.66,25.88 43.66,24.29 44.93,23.02 45.56,23.02 46.2,23.65 48.42,23.65 49.53,24.77 49.53,25.08 IC3.21 | v43.66,46.2 46.04,46.2 v46.67,46.83
N$82  (via drill 0.3)
  Top 0.203: v49.69,26.35 49.69,28.26 49.05,28.89 49.05,33.34 v49.69,33.97 | v56.83,35.56 v54.45,35.56 | v60.01,37.62 60.01,37.94 59.53,38.42 v59.53,40.16 | v59.53,44.13 59.53,48.26 59.05,48.74 R22.2
  Bottom 0.203: v49.69,26.35 49.53,26.35 48.9,25.72 48.9,25.24 IC3.22 | v49.69,33.97 50.32,33.97 51.91,35.56 v54.45,35.56 | v56.83,35.56 57.94,35.56 v60.01,37.62 | v59.53,44.13 v59.53,40.16
PRV_TALLY  (via drill 0.3)
  Top 0.203: v107,25.08 108.11,23.97 109.86,23.97 R39.2 | v93.5,26.04 v98.27,26.04 | v76.04,30.48 v78.11,30.48 | v65.41,36.2 65.09,36.2 62.23,39.05 v62.23,39.85 | v61.44,41.43 60.48,41.43 53.34,48.58 50.96,48.58 v44.61,54.93 | v43.02,64.93 v37.62,59.53
  Bottom 0.203: v107,25.08 101.76,30.32 100.81,30.32 98.27,27.78 v98.27,26.04 | v93.5,26.04 91.12,26.04 88.11,23.02 88.11,22.23 87.47,21.59 84.45,21.59 83.03,23.02 78.74,23.02 78.11,23.65 v78.11,30.48 | v76.04,30.48 75.72,30.48 70.01,36.2 v65.41,36.2 | v62.23,39.85 61.44,40.64 v61.44,41.43 | v44.61,54.93 41.27,54.93 37.62,58.58 v37.62,59.53 | v43.02,64.93 51.75,64.93 53.02,66.2 GND.D4
PWM_IRIS  (via drill 0.3)
  Top 0.203: v85.25,54.29 87.31,52.23 R11.2 | v85.25,66.83 65.56,66.83 63.66,64.93 51.91,64.93 50.64,66.2 GND.D5
  Bottom 0.203: v85.25,66.83 v85.25,54.29
RES
  Top 0.203: RESET.1 RESETA.1
  Bottom 0.203: RESET.1 19.05,11.43 23.65,16.03 30,16.03 31.91,17.94 32.7,17.94 GND.RES
RESET
  Top 0.203: T6.3 110.01,16.99 116.68,16.99 X6.3
VIN  (via drill 0.3)
  Top 0.305: C15.1 91.12,61.91 91.12,60.01 C7.1 91.12,59.85 87.31,59.85 85.88,58.42 85.88,54.93 86.68,54.13 87.31,54.13 IC5.8 87.47,53.98 v89.85,51.59 | v92.23,48.26 92.71,48.26 v93.98,46.99
  Bottom 0.305: v89.85,51.59 89.85,50.64 v92.23,48.26 | v93.98,46.99 94.77,46.2 L1.2
  Bottom 0.61: L1.2 94.85,45.95 C9.1 94.85,32.15 97,30 97,17 96,16 47.52,16 GND.VIN

## Text on the board
_tsilk: SCL SDA
_bsilk: SKAARHOJ 2015 | v05-15(2) | PCB-CCU-IRISCTRL | GITHUB: SKAARHOJ-Open-Engineering | OUTPUT | INPUT